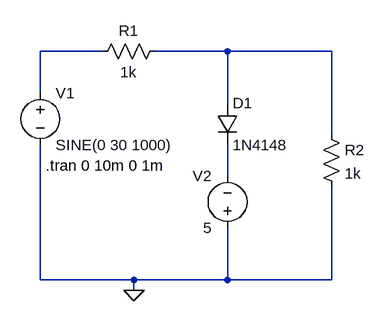
[diagram p0: schematic Positve Biased Clipper.asc]
Positve Biased Clipper.asc, the LTspice schematic file:
Version 4
SHEET 1 880 680
WIRE 384 176 288 176
WIRE 576 176 464 176
WIRE 736 176 576 176
WIRE 288 240 288 176
WIRE 576 256 576 176
WIRE 736 304 736 176
WIRE 576 368 576 320
WIRE 288 528 288 320
WIRE 432 528 288 528
WIRE 576 528 576 448
WIRE 576 528 432 528
WIRE 736 528 736 384
WIRE 736 528 576 528
WIRE 432 544 432 528
FLAG 432 544 0
SYMBOL res 480 160 R90
WINDOW 0 0 56 VBottom 2
WINDOW 3 32 56 VTop 2
SYMATTR InstName R1
SYMATTR Value 1k
SYMBOL diode 560 256 R0
SYMATTR InstName D1
SYMATTR Value 1N4148
SYMBOL voltage 288 224 R0
SYMATTR InstName V1
SYMATTR Value SINE(0 30 1000)
SYMBOL res 720 288 R0
SYMATTR InstName R2
SYMATTR Value 1k
SYMBOL voltage 576 464 R180
WINDOW 0 24 96 Left 2
WINDOW 3 24 16 Left 2
SYMATTR InstName V2
SYMATTR Value 5
TEXT 296 352 Left 2 !.tran 0 10m 0 1m

The netlist it stands for:
* Positve Biased Clipper.asc
R1 N002 N001 1k
D1 N002 N003 1N4148
V1 N001 0 SINE(0 30 1000)
R2 N002 0 1k
V2 0 N003 5
.model D D
.lib standard.dio
.tran 0 10m 0 1m
.backanno
.end